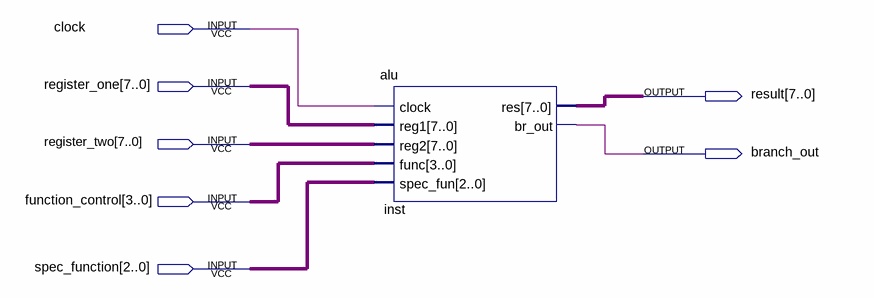
[diagram p0: schematic sheet]
// Quartus schematic alu_bench_diagram.bdf as structural Verilog: 1 symbols, 7 pins
module alu_bench_diagram (
  input  clock,
  input  [7:0] register_one,
  input  [7:0] register_two,
  input  [3:0] function_control,
  input  [2:0] spec_function,
  output [7:0] result,
  output branch_out
);

  alu inst (
    .clock(clock), .reg1(register_one), .reg2(register_two), .func(function_control),
    .spec_fun(spec_function), .res(result), .br_out(branch_out));
endmodule
